# Altium schematic sheet NRF52840_UFO.SchDoc: UFO Target
size Letter; Organization: NewAE Technology Inc.; Address1: 1083 Queen St., Suite 196; Address2: Halifax; Address3: NS; Address4: Canada B3H 0B2; SheetApproved: NO
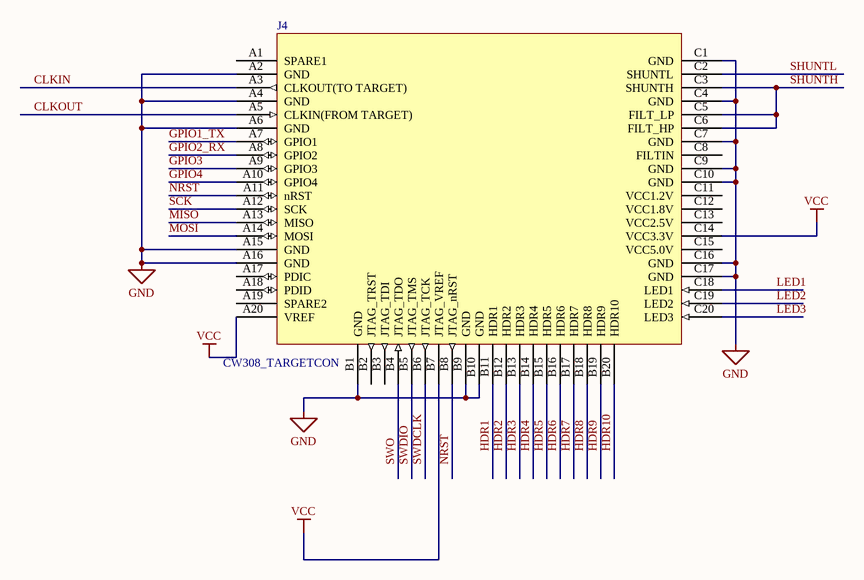
[diagram p0: NRF52840_UFO.SchDoc]

## Parts
J4  CW308_TARGETCON  [CW308_TBOARD_CONN]

## Nets
GND: J4.A2(GND) J4.A4(GND) J4.A6(GND) J4.A15(GND) J4.A16(GND) J4.B1(GND) J4.B9(GND) J4.B10(GND) J4.C1(GND) J4.C4(GND) J4.C7(GND) J4.C9(GND) J4.C10(GND) J4.C16(GND) J4.C17(GND)
VCC: J4.A20(VREF) J4.B7(JTAG_VREF) J4.C14(VCC3.3V)
CLKIN: J4.A3(CLKOUT(TO_TARGET))
CLKOUT: J4.A5(CLKIN(FROM_TARGET))
GPIO1_TX: J4.A7(GPIO1)
GPIO2_RX: J4.A8(GPIO2)
GPIO3: J4.A9(GPIO3)
GPIO4: J4.A10(GPIO4)
HDR1: J4.B11(HDR1)
HDR2: J4.B12(HDR2)
HDR3: J4.B13(HDR3)
HDR4: J4.B14(HDR4)
HDR5: J4.B15(HDR5)
HDR6: J4.B16(HDR6)
HDR7: J4.B17(HDR7)
HDR8: J4.B18(HDR8)
HDR9: J4.B19(HDR9)
HDR10: J4.B20(HDR10)
LED1: J4.C18(LED1)
LED2: J4.C19(LED2)
LED3: J4.C20(LED3)
MISO: J4.A13(MISO)
MOSI: J4.A14(MOSI)
NRST: J4.A11(nRST) J4.B8(JTAG_nRST)
SCK: J4.A12(SCK)
SHUNTH: J4.C3(SHUNTH) J4.C5(FILT_LP) J4.C6(FILT_HP)
SHUNTL: J4.C2(SHUNTL)
SWDCLK: J4.B6(JTAG_TCK)
SWDIO: J4.B5(JTAG_TMS)
SWO: J4.B4(JTAG_TDO)

Not connected (* = marked no-connect by the designer): J4 A1(SPARE1) A17(PDIC) A18(PDID) A19(SPARE2) B2(JTAG_TRST) B3(JTAG_TDI) C8(FILTIN) C11(VCC1.2V) C12(VCC1.8V) C13(VCC2.5V) C15(VCC5.0V)

## Notes on the sheet
- Title:
- Date:
- Rev:
- Time:
- Project:
- Sheet
- of
- License:
- Copyright © NewAE Technology Inc.
- Approved:
- NewAE.com
- File:

## Library data of the parts
J4 = CW308_TBOARD: CW308 "Standard" Target Board Connector; Component Group: Mechanical; Pitch: 2.54mm; Part Number: CW308_TBOARD; Pin Count: 60; Mounting Technology: Through-hole; Component Kind: Standard; Component Type: Standard